# Altium project DEV Board.PrjPCB
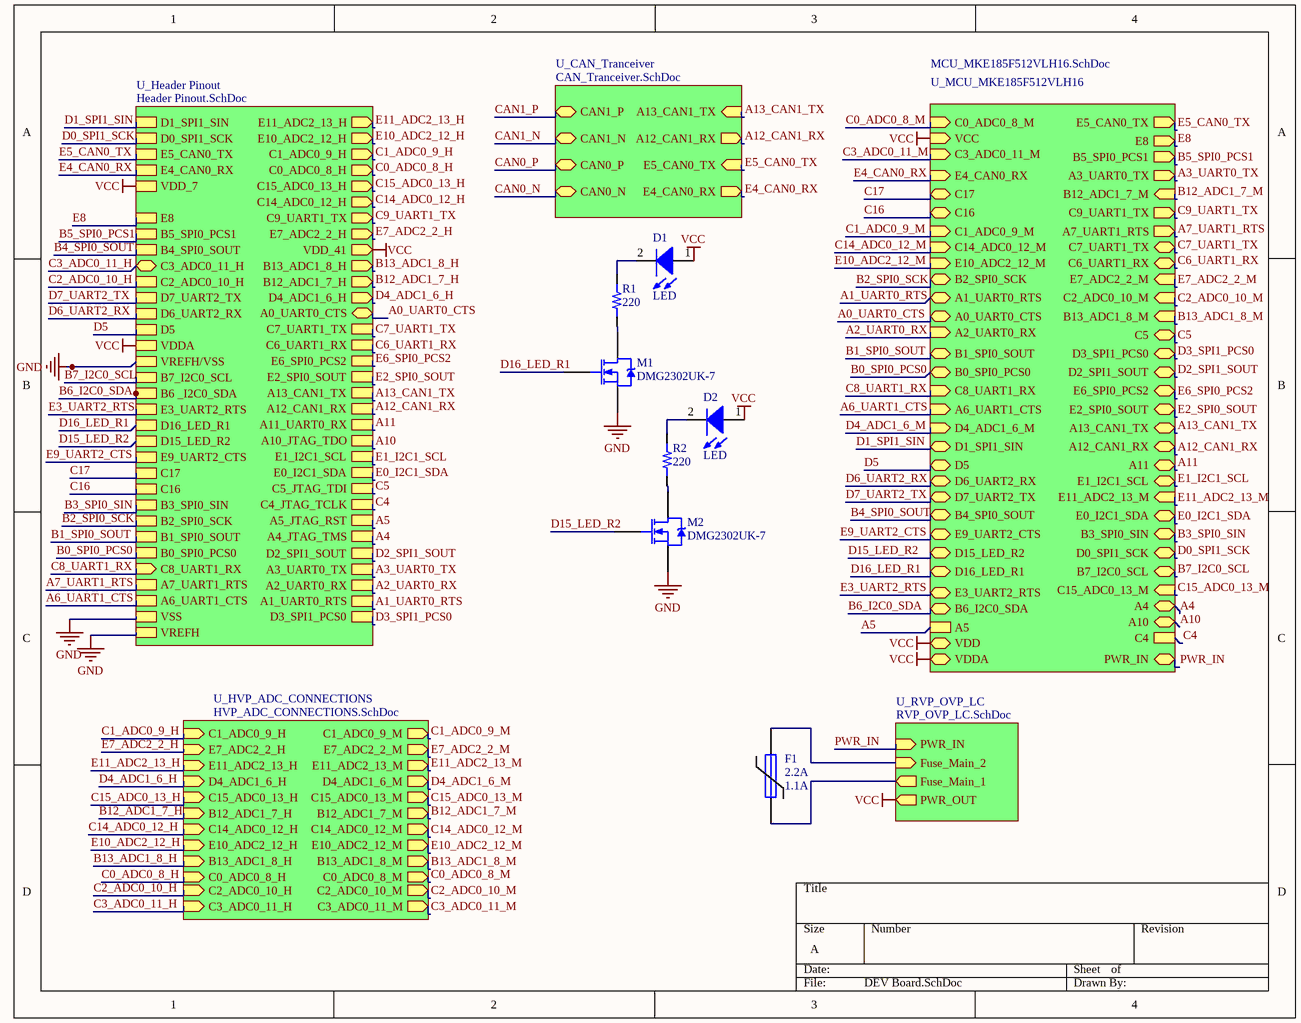
[diagram p0: DEV Board.SchDoc]
5 sheets, 69 parts. Net scope: hierarchical (ports join the sheet entries above them; power ports are global).
Board file: DEV BOARD PCB.PcbDoc
Sheets:
  DEV Board.SchDoc
    U_MCU_MKE185F512VLH16 = MCU_MKE185F512VLH16.SchDoc
    U_CAN_Tranceiver = CAN_Tranceiver.SchDoc
    U_HVP_ADC_CONNECTIONS = HVP_ADC_CONNECTIONS.SchDoc
    U_Header Pinout = Header Pinout.SchDoc

## Sheet DEV Board.SchDoc
size A

### Parts
D1  LED  [0805_LED]
D2  LED  [0805_LED]
F1  2.2A  I_hold: 1.1A  [PIN-W2/E2.8]
M1  DMG2302UK-7  [SOT23-3]
M2  DMG2302UK-7  [SOT23-3]
R1  value 220  [RES 0402/1005]  (hidden comment: Resistor 220 0402 1/10W 1%)
R2  value 220  [RES 0402/1005]  (hidden comment: Resistor 220 0402 1/10W 1%)

### Sub-sheets
U_CAN_Tranceiver = CAN_Tranceiver.SchDoc: A12_CAN1_RX (out), A13_CAN1_TX (in), CAN1_P (bidir), CAN1_N (bidir), E4_CAN0_RX (out), E5_CAN0_TX (in), CAN0_P (bidir), CAN0_N (bidir)
U_Header Pinout = Header Pinout.SchDoc: D1_SPI1_SIN, D0_SPI1_SCK, E11_ADC2_13_H (out), E10_ADC2_12_H (out), E5_CAN0_TX, E4_CAN0_RX, E8, B5_SPI0_PCS1, B4_SPI0_SOUT, D7_UART2_TX, D6_UART2_RX, D5, VDDA, B7_I2C0_SCL, E3_UART2_RTS, E9_UART2_CTS, C1_ADC0_9_H (out), C0_ADC0_8_H (out), C17, C16, C15_ADC0_13_H (out), C14_ADC0_12_H (out), B3_SPI0_SIN, B2_SPI0_SCK, B1_SPI0_SOUT, B0_SPI0_PCS0, C9_UART1_TX (out), C8_UART1_RX (in), A7_UART1_RTS, A6_UART1_CTS, E7_ADC2_2_H (out), VSS, B13_ADC1_8_H (out), B12_ADC1_7_H (out), D4_ADC1_6_H (out), D3_SPI1_PCS0, D2_SPI1_SOUT, A3_UART0_TX, A2_UART0_RX, A1_UART0_RTS, C7_UART1_TX, C6_UART1_RX, E6_SPI0_PCS2, E2_SPI0_SOUT, A13_CAN1_TX, A12_CAN1_RX, A11_UART0_RX, A10_JTAG_TDO, E1_I2C1_SCL, E0_I2C1_SDA, C5_JTAG_TDI, C4_JTAG_TCLK, A5_JTAG_RST, A4_JTAG_TMS, C3_ADC0_11_H (bidir), C2_ADC0_10_H, D16_LED_R1, D15_LED_R2, A0_UART0_CTS (bidir), B6 _I2C0_SDA, VREFH/VSS, VREFH, VDD_7, VDD_41 (out)
U_HVP_ADC_CONNECTIONS = HVP_ADC_CONNECTIONS.SchDoc: B13_ADC1_8_M (out), C15_ADC0_13_M (out), E10_ADC2_12_M (out), E7_ADC2_2_M (out), C14_ADC0_12_M (out), C0_ADC0_8_M (out), E11_ADC2_13_M (out), D4_ADC1_6_M (out), C1_ADC0_9_M (out), B12_ADC1_7_M (out), C1_ADC0_9_H (in), E7_ADC2_2_H (in), E11_ADC2_13_H (in), D4_ADC1_6_H (in), C15_ADC0_13_H (in), C14_ADC0_12_H (in), E10_ADC2_12_H (in), B13_ADC1_8_H (in), C0_ADC0_8_H (in), C2_ADC0_10_H (in), C3_ADC0_11_H (in), C3_ADC0_11_M (out), C2_ADC0_10_M (out), B12_ADC1_7_H (in)
U_MCU_MKE185F512VLH16 = MCU_MKE185F512VLH16.SchDoc: E5_CAN0_TX (out), E4_CAN0_RX (in), E8 (out), B5_SPI0_PCS1 (out), C17 (bidir), C16 (bidir), B3_SPI0_SIN (bidir), B2_SPI0_SCK (bidir), A1_UART0_RTS (bidir), A0_UART0_CTS (bidir), A3_UART0_TX (out), A2_UART0_RX (in), B1_SPI0_SOUT (bidir), B0_SPI0_PCS0 (bidir), C9_UART1_TX (out), C8_UART1_RX (in), A7_UART1_RTS (out), A6_UART1_CTS (in), D5 (bidir), D6_UART2_RX (bidir), D7_UART2_TX (bidir), B4_SPI0_SOUT (bidir), E9_UART2_CTS (bidir), E3_UART2_RTS (bidir), B6_I2C0_SDA (bidir), B7_I2C0_SCL (bidir), D0_SPI1_SCK (bidir), D1_SPI1_SIN (bidir), C7_UART1_TX (bidir), C6_UART1_RX (bidir), E6_SPI0_PCS2 (bidir), E2_SPI0_SOUT (bidir), A13_CAN1_TX (bidir), A12_CAN1_RX (bidir), A11 (bidir), E1_I2C1_SCL (bidir), E0_I2C1_SDA (bidir), D2_SPI1_SOUT (bidir), C5 (bidir), VCC (in), C2_ADC0_10_M (in), C3_ADC0_11_M (in), C1_ADC0_9_M (in), C0_ADC0_8_M (in), C14_ADC0_12_M (in), C15_ADC0_13_M (in), D4_ADC1_6_M (in), E10_ADC2_12_M (in), B12_ADC1_7_M (in), E7_ADC2_2_M (in), E11_ADC2_13_M (in), B13_ADC1_8_M (in), D15_LED_R2 (bidir), D16_LED_R1 (bidir), A4 (bidir), A10 (bidir), C4, A5, D3_SPI1_PCS0 (bidir), VDD (bidir), VDDA (bidir), PWR_IN (bidir)
U_RVP_OVP_LC = RVP_OVP_LC.SchDoc (file not in this document): PWR_IN (in), Fuse_Main_2 (in), Fuse_Main_1 (out), PWR_OUT (out)

### Nets
GND: M1.2(S) M2.2(S) ; sheet U_Header Pinout/VSS, sheet U_Header Pinout/VREFH/VSS, sheet U_Header Pinout/VREFH
VCC: D1.1(A) D2.1(A) ; sheet U_MCU_MKE185F512VLH16/VCC, sheet U_MCU_MKE185F512VLH16/VDD, sheet U_MCU_MKE185F512VLH16/VDDA, sheet U_RVP_OVP_LC/PWR_OUT, sheet U_Header Pinout/VDDA, sheet U_Header Pinout/VDD_7, sheet U_Header Pinout/VDD_41
A0_UART0_CTS: sheet U_MCU_MKE185F512VLH16/A0_UART0_CTS, sheet U_Header Pinout/A0_UART0_CTS
A1_UART0_RTS: sheet U_MCU_MKE185F512VLH16/A1_UART0_RTS, sheet U_Header Pinout/A1_UART0_RTS
A2_UART0_RX: sheet U_MCU_MKE185F512VLH16/A2_UART0_RX, sheet U_Header Pinout/A2_UART0_RX
A3_UART0_TX: sheet U_MCU_MKE185F512VLH16/A3_UART0_TX, sheet U_Header Pinout/A3_UART0_TX
A4: sheet U_MCU_MKE185F512VLH16/A4, sheet U_Header Pinout/A4_JTAG_TMS
A5: sheet U_MCU_MKE185F512VLH16/A5, sheet U_Header Pinout/A5_JTAG_RST
A6_UART1_CTS: sheet U_MCU_MKE185F512VLH16/A6_UART1_CTS, sheet U_Header Pinout/A6_UART1_CTS
A7_UART1_RTS: sheet U_MCU_MKE185F512VLH16/A7_UART1_RTS, sheet U_Header Pinout/A7_UART1_RTS
A10: sheet U_MCU_MKE185F512VLH16/A10, sheet U_Header Pinout/A10_JTAG_TDO
A11: sheet U_MCU_MKE185F512VLH16/A11, sheet U_Header Pinout/A11_UART0_RX
A12_CAN1_RX: sheet U_MCU_MKE185F512VLH16/A12_CAN1_RX, sheet U_CAN_Tranceiver/A12_CAN1_RX, sheet U_Header Pinout/A12_CAN1_RX
A13_CAN1_TX: sheet U_MCU_MKE185F512VLH16/A13_CAN1_TX, sheet U_CAN_Tranceiver/A13_CAN1_TX, sheet U_Header Pinout/A13_CAN1_TX
B0_SPI0_PCS0: sheet U_MCU_MKE185F512VLH16/B0_SPI0_PCS0, sheet U_Header Pinout/B0_SPI0_PCS0
B1_SPI0_SOUT: sheet U_MCU_MKE185F512VLH16/B1_SPI0_SOUT, sheet U_Header Pinout/B1_SPI0_SOUT
B2_SPI0_SCK: sheet U_MCU_MKE185F512VLH16/B2_SPI0_SCK, sheet U_Header Pinout/B2_SPI0_SCK
B3_SPI0_SIN: sheet U_MCU_MKE185F512VLH16/B3_SPI0_SIN, sheet U_Header Pinout/B3_SPI0_SIN
B4_SPI0_SOUT: sheet U_MCU_MKE185F512VLH16/B4_SPI0_SOUT, sheet U_Header Pinout/B4_SPI0_SOUT
B5_SPI0_PCS1: sheet U_MCU_MKE185F512VLH16/B5_SPI0_PCS1, sheet U_Header Pinout/B5_SPI0_PCS1
B6_I2C0_SDA: sheet U_MCU_MKE185F512VLH16/B6_I2C0_SDA, sheet U_Header Pinout/B6 _I2C0_SDA
B7_I2C0_SCL: sheet U_MCU_MKE185F512VLH16/B7_I2C0_SCL, sheet U_Header Pinout/B7_I2C0_SCL
B12_ADC1_7_H: sheet U_HVP_ADC_CONNECTIONS/B12_ADC1_7_H, sheet U_Header Pinout/B12_ADC1_7_H
B12_ADC1_7_M: sheet U_MCU_MKE185F512VLH16/B12_ADC1_7_M, sheet U_HVP_ADC_CONNECTIONS/B12_ADC1_7_M
B13_ADC1_8_H: sheet U_HVP_ADC_CONNECTIONS/B13_ADC1_8_H, sheet U_Header Pinout/B13_ADC1_8_H
B13_ADC1_8_M: sheet U_MCU_MKE185F512VLH16/B13_ADC1_8_M, sheet U_HVP_ADC_CONNECTIONS/B13_ADC1_8_M
C0_ADC0_8_H: sheet U_HVP_ADC_CONNECTIONS/C0_ADC0_8_H, sheet U_Header Pinout/C0_ADC0_8_H
C0_ADC0_8_M: sheet U_MCU_MKE185F512VLH16/C0_ADC0_8_M, sheet U_HVP_ADC_CONNECTIONS/C0_ADC0_8_M
C1_ADC0_9_H: sheet U_HVP_ADC_CONNECTIONS/C1_ADC0_9_H, sheet U_Header Pinout/C1_ADC0_9_H
C1_ADC0_9_M: sheet U_MCU_MKE185F512VLH16/C1_ADC0_9_M, sheet U_HVP_ADC_CONNECTIONS/C1_ADC0_9_M
C2_ADC0_10_H: sheet U_HVP_ADC_CONNECTIONS/C2_ADC0_10_H, sheet U_Header Pinout/C2_ADC0_10_H
C2_ADC0_10_M: sheet U_MCU_MKE185F512VLH16/C2_ADC0_10_M, sheet U_HVP_ADC_CONNECTIONS/C2_ADC0_10_M
C3_ADC0_11_H: sheet U_HVP_ADC_CONNECTIONS/C3_ADC0_11_H, sheet U_Header Pinout/C3_ADC0_11_H
C3_ADC0_11_M: sheet U_MCU_MKE185F512VLH16/C3_ADC0_11_M, sheet U_HVP_ADC_CONNECTIONS/C3_ADC0_11_M
C4: sheet U_MCU_MKE185F512VLH16/C4, sheet U_Header Pinout/C4_JTAG_TCLK
C5: sheet U_MCU_MKE185F512VLH16/C5, sheet U_Header Pinout/C5_JTAG_TDI
C6_UART1_RX: sheet U_MCU_MKE185F512VLH16/C6_UART1_RX, sheet U_Header Pinout/C6_UART1_RX
C7_UART1_TX: sheet U_MCU_MKE185F512VLH16/C7_UART1_TX, sheet U_Header Pinout/C7_UART1_TX
C8_UART1_RX: sheet U_MCU_MKE185F512VLH16/C8_UART1_RX, sheet U_Header Pinout/C8_UART1_RX
C9_UART1_TX: sheet U_MCU_MKE185F512VLH16/C9_UART1_TX, sheet U_Header Pinout/C9_UART1_TX
C14_ADC0_12_H: sheet U_HVP_ADC_CONNECTIONS/C14_ADC0_12_H, sheet U_Header Pinout/C14_ADC0_12_H
C14_ADC0_12_M: sheet U_MCU_MKE185F512VLH16/C14_ADC0_12_M, sheet U_HVP_ADC_CONNECTIONS/C14_ADC0_12_M
C15_ADC0_13_H: sheet U_HVP_ADC_CONNECTIONS/C15_ADC0_13_H, sheet U_Header Pinout/C15_ADC0_13_H
C15_ADC0_13_M: sheet U_MCU_MKE185F512VLH16/C15_ADC0_13_M, sheet U_HVP_ADC_CONNECTIONS/C15_ADC0_13_M
C16: sheet U_MCU_MKE185F512VLH16/C16, sheet U_Header Pinout/C16
C17: sheet U_MCU_MKE185F512VLH16/C17, sheet U_Header Pinout/C17
D0_SPI1_SCK: sheet U_MCU_MKE185F512VLH16/D0_SPI1_SCK, sheet U_Header Pinout/D0_SPI1_SCK
D1_SPI1_SIN: sheet U_MCU_MKE185F512VLH16/D1_SPI1_SIN, sheet U_Header Pinout/D1_SPI1_SIN
D2_SPI1_SOUT: sheet U_MCU_MKE185F512VLH16/D2_SPI1_SOUT, sheet U_Header Pinout/D2_SPI1_SOUT
D3_SPI1_PCS0: sheet U_MCU_MKE185F512VLH16/D3_SPI1_PCS0, sheet U_Header Pinout/D3_SPI1_PCS0
D4_ADC1_6_H: sheet U_HVP_ADC_CONNECTIONS/D4_ADC1_6_H, sheet U_Header Pinout/D4_ADC1_6_H
D4_ADC1_6_M: sheet U_MCU_MKE185F512VLH16/D4_ADC1_6_M, sheet U_HVP_ADC_CONNECTIONS/D4_ADC1_6_M
D5: sheet U_MCU_MKE185F512VLH16/D5, sheet U_Header Pinout/D5
D6_UART2_RX: sheet U_MCU_MKE185F512VLH16/D6_UART2_RX, sheet U_Header Pinout/D6_UART2_RX
D7_UART2_TX: sheet U_MCU_MKE185F512VLH16/D7_UART2_TX, sheet U_Header Pinout/D7_UART2_TX
D15_LED_R2: M2.1(G) ; sheet U_MCU_MKE185F512VLH16/D15_LED_R2, sheet U_Header Pinout/D15_LED_R2
D16_LED_R1: M1.1(G) ; sheet U_MCU_MKE185F512VLH16/D16_LED_R1, sheet U_Header Pinout/D16_LED_R1
E0_I2C1_SDA: sheet U_MCU_MKE185F512VLH16/E0_I2C1_SDA, sheet U_Header Pinout/E0_I2C1_SDA
E1_I2C1_SCL: sheet U_MCU_MKE185F512VLH16/E1_I2C1_SCL, sheet U_Header Pinout/E1_I2C1_SCL
E2_SPI0_SOUT: sheet U_MCU_MKE185F512VLH16/E2_SPI0_SOUT, sheet U_Header Pinout/E2_SPI0_SOUT
E3_UART2_RTS: sheet U_MCU_MKE185F512VLH16/E3_UART2_RTS, sheet U_Header Pinout/E3_UART2_RTS
E4_CAN0_RX: sheet U_MCU_MKE185F512VLH16/E4_CAN0_RX, sheet U_CAN_Tranceiver/E4_CAN0_RX, sheet U_Header Pinout/E4_CAN0_RX
E5_CAN0_TX: sheet U_MCU_MKE185F512VLH16/E5_CAN0_TX, sheet U_CAN_Tranceiver/E5_CAN0_TX, sheet U_Header Pinout/E5_CAN0_TX
E6_SPI0_PCS2: sheet U_MCU_MKE185F512VLH16/E6_SPI0_PCS2, sheet U_Header Pinout/E6_SPI0_PCS2
E7_ADC2_2_H: sheet U_HVP_ADC_CONNECTIONS/E7_ADC2_2_H, sheet U_Header Pinout/E7_ADC2_2_H
E7_ADC2_2_M: sheet U_MCU_MKE185F512VLH16/E7_ADC2_2_M, sheet U_HVP_ADC_CONNECTIONS/E7_ADC2_2_M
E8: sheet U_MCU_MKE185F512VLH16/E8, sheet U_Header Pinout/E8
E9_UART2_CTS: sheet U_MCU_MKE185F512VLH16/E9_UART2_CTS, sheet U_Header Pinout/E9_UART2_CTS
E10_ADC2_12_H: sheet U_HVP_ADC_CONNECTIONS/E10_ADC2_12_H, sheet U_Header Pinout/E10_ADC2_12_H
E10_ADC2_12_M: sheet U_MCU_MKE185F512VLH16/E10_ADC2_12_M, sheet U_HVP_ADC_CONNECTIONS/E10_ADC2_12_M
E11_ADC2_13_H: sheet U_HVP_ADC_CONNECTIONS/E11_ADC2_13_H, sheet U_Header Pinout/E11_ADC2_13_H
E11_ADC2_13_M: sheet U_MCU_MKE185F512VLH16/E11_ADC2_13_M, sheet U_HVP_ADC_CONNECTIONS/E11_ADC2_13_M
PWR_IN: sheet U_MCU_MKE185F512VLH16/PWR_IN, sheet U_RVP_OVP_LC/PWR_IN
NetD1_2: D1.2(K) R1.2
NetD2_2: D2.2(K) R2.2
NetF1_1: F1.1 ; sheet U_RVP_OVP_LC/Fuse_Main_1
NetF1_2: F1.2 ; sheet U_RVP_OVP_LC/Fuse_Main_2
NetM1_3: M1.3(D) R1.1
NetM2_3: M2.3(D) R2.1

### Library data of the parts
D1 D2 = 1: idLED: 1; Name: LED_0805_RED; Value: Red; Vf: 0.7V; Manufacturer_id: 1; Drawer_id: 1; Package: 0805
F1 = 8: Fuse; Manufacturer_id: 1; MfrPartNo: 1206L110/12SLYR; idFuse: 8; Name: Resettable; I_max: 50A; V_max: 12V; Pd_Typ: .8W; Published: 8-Jun-2000; LatestRevisionDate: 17-Jul-2002; LatestRevisionNote: Re-released for DXP Platform.; PackageReference: PIN-W2/E2.8; Publisher: Altium Limited; PackageDescription: Thru-Hole; 2 Leads; Drawer_id: 1; I_trip: 2.2A; Link: https://www.digikey.com/product-detail/en/littelfuse-inc/1206L110-12SLYR/F5764CT-ND/3593809
M1 M2 = 6: MOSFET N-CHANNEL 30V 5A SOT23; Manufacturer_id: 1; idFETs: 6; Value: N_Channel; Vdss: 20V; Id: 2.8A; Rds_On: 90mOhm; Vgs(typ): 800mV; Vgs(Max): 1V; Created_By: Angel; MfrPartNo: DMG2302UK-7; Drawer_id: 1; Name: DMG2302UK-7; Num_Circuits: 1; Package: SOT-23; Link: https://www.digikey.com/product-detail/en/diodes-incorporated/DMG2302UK-7/DMG2302UK-7DICT-ND/6010163; Supplier1: Digi-Key
R1 R2 = 57: Manufacturer_id: 1; idResistor: 57; Name: Res_220_0402_1/10W_1%; Created_By: Nick Mah; Supplier 1: Digi-Key; Drawer_id: 1; Tolerance: 1%; Power: 1/10W; Package: 0402; ComponentLink1Description: Datasheet; Created_Date: 2018-10-20

## Sheet MCU_MKE185F512VLH16.SchDoc: Microcontroller
size A4; DrawnBy: Alvin Ha; DocumentNumber: MCU2018-2; Revision: 2.0; SheetNumber: 2; SheetTotal: 4
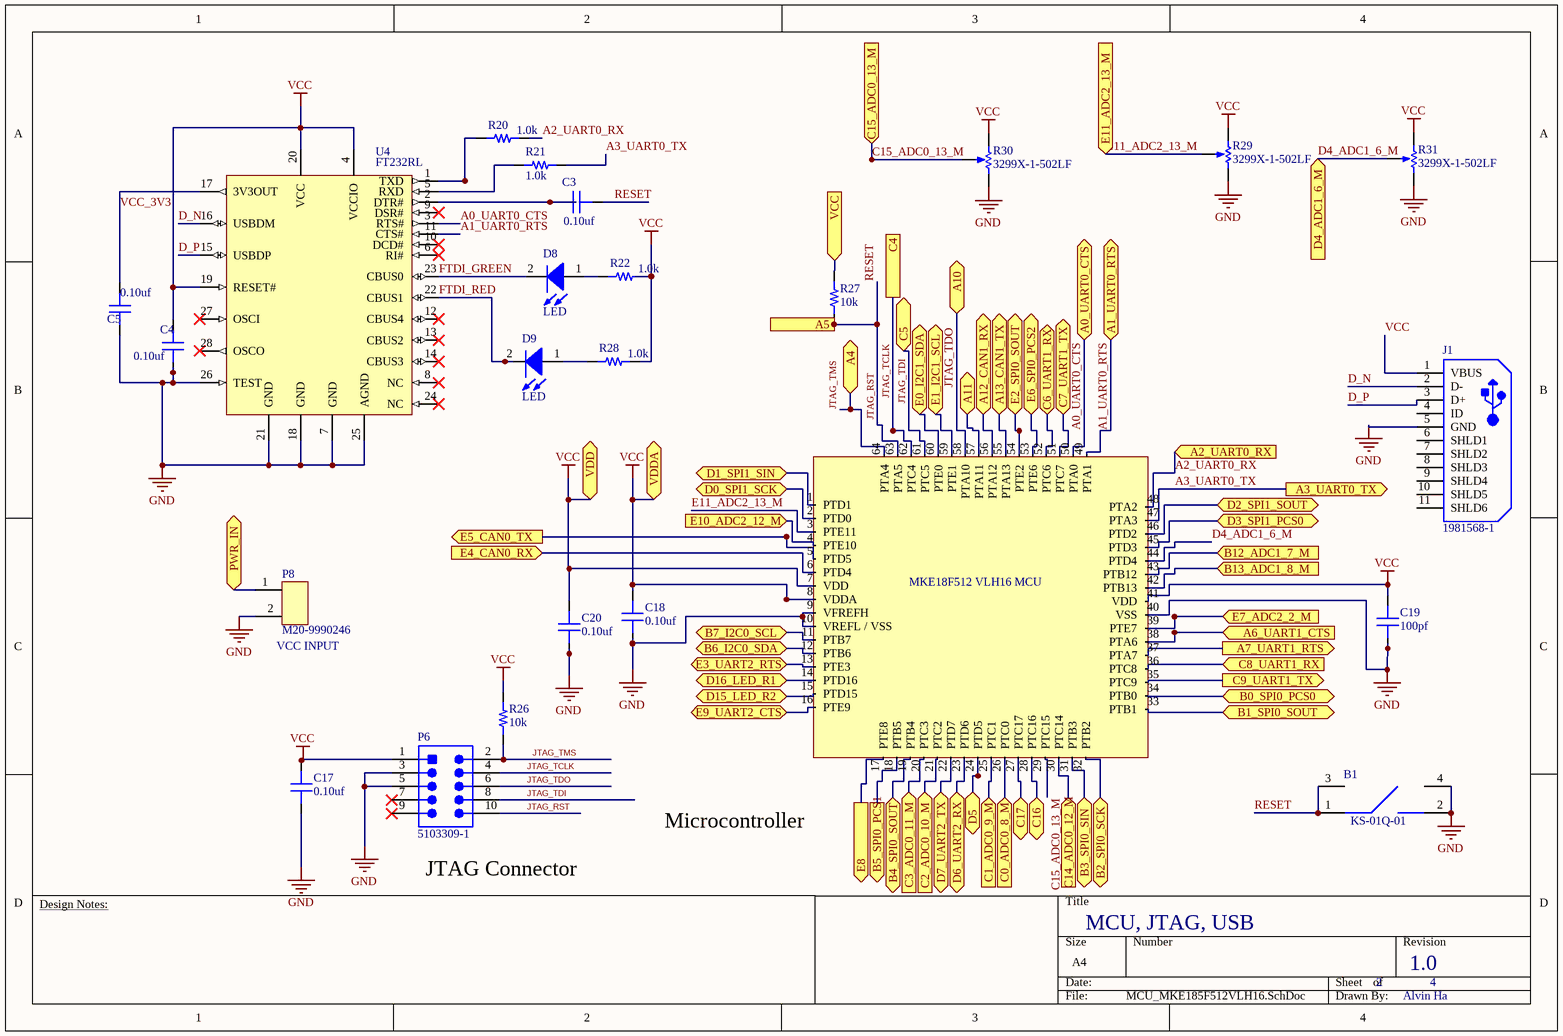
[diagram p1: MCU_MKE185F512VLH16.SchDoc]

### Parts
B1  KS-01Q-01  [KS-01Q-01]
C3  value 0.10uf  [CAP 0603/1608]  (hidden comment: Capacitor MLCC 0.10uf 25V CAP 0603/1608)
C4  value 0.10uf  [CAP 0603/1608]  (hidden comment: Capacitor MLCC 0.10uf 25V CAP 0603/1608)
C5  value 0.10uf  [CAP 0603/1608]  (hidden comment: Capacitor MLCC 0.10uf 25V CAP 0603/1608)
C17  value 0.10uf  [CAP 0603/1608]  (hidden comment: Capacitor MLCC 0.10uf 16V CAP 0603/1608)
C18  value 0.10uf  [CAP 0603/1608]  (hidden comment: Capacitor MLCC 0.10uf 25V CAP 0603/1608)
C19  value 100pf  [CAP 0603/1608]  (hidden comment: Capacitor MLCC 100pf 25V CAP 0603/1608)
C20  value 0.10uf  [CAP 0603/1608]  (hidden comment: Capacitor MLCC 0.10uf 25V CAP 0603/1608)
D8  LED  [0805_LED]
D9  LED  [0805_LED]
J1  1981568-1  [TECO-1981568-5_V]
P6  5103309-1  [HDR2X5_SMT]
P8  M20-9990246  [M20-9990246]
R20  value 1.0k  [RES 0805/2012]  (hidden comment: Resistor 1.0k 0805 1/4W 1%)
R21  value 1.0k  [RES 0805/2012]  (hidden comment: Resistor 1.0k 0805 1/4W 1%)
R22  value 1.0k  [RES 0805/2012]  (hidden comment: Resistor 1.0k 0805 1/4W 1%)
R26  value 10k  [RES 0603/1608]  (hidden comment: Resistor 10k 0603 1/10W 1%)
R27  value 10k  [RES 0603/1608]  (hidden comment: Resistor 10k 0603 1/10W 5%)
R28  value 1.0k  [RES 0805/2012]  (hidden comment: Resistor 1.0k 0805 1/4W 1%)
R29  3299X-1-502LF  [3299X-1-502LF]
R30  3299X-1-502LF  [3299X-1-502LF]
R31  3299X-1-502LF  [3299X-1-502LF]
U3  MKE18F512 VLH16 MCU  [TQFP64]
U4  FT232RL  [SSOP-28]

### Ports
A0_UART0_CTS (bidir), A1_UART0_RTS (bidir), A2_UART0_RX (in), A3_UART0_TX (out), A4 (bidir), A5, A6_UART1_CTS (in), A7_UART1_RTS (out), A10 (bidir), A11 (bidir), A12_CAN1_RX (bidir), A13_CAN1_TX (bidir), B0_SPI0_PCS0 (bidir), B1_SPI0_SOUT (bidir), B2_SPI0_SCK (bidir), B3_SPI0_SIN (bidir), B4_SPI0_SOUT (bidir), B5_SPI0_PCS1 (out), B6_I2C0_SDA (bidir), B7_I2C0_SCL (bidir), B12_ADC1_7_M (in), B13_ADC1_8_M (in), C0_ADC0_8_M (in), C1_ADC0_9_M (in), C2_ADC0_10_M (in), C3_ADC0_11_M (in), C4, C5 (bidir), C6_UART1_RX (bidir), C7_UART1_TX (bidir), C8_UART1_RX (in), C9_UART1_TX (out), C14_ADC0_12_M (in), C15_ADC0_13_M (in), C16 (bidir), C17 (bidir), D0_SPI1_SCK (bidir), D1_SPI1_SIN (bidir), D2_SPI1_SOUT (bidir), D3_SPI1_PCS0 (bidir), D4_ADC1_6_M (in), D5 (bidir), D6_UART2_RX (bidir), D7_UART2_TX (bidir), D15_LED_R2 (bidir), D16_LED_R1 (bidir), E0_I2C1_SDA (bidir), E1_I2C1_SCL (bidir), E2_SPI0_SOUT (bidir), E3_UART2_RTS (bidir), E4_CAN0_RX (in), E5_CAN0_TX (out), E6_SPI0_PCS2 (bidir), E7_ADC2_2_M (in), E8 (out), E9_UART2_CTS (bidir), E10_ADC2_12_M (in), E11_ADC2_13_M (in), PWR_IN (bidir), VCC (in), VDD (bidir), VDDA (bidir)

### Nets
GND: B1.2 B1.4 C4.1 C5.1 C17.1 C18.1 C19.1 C20.1 J1.5(GND) P6.3 P6.5 R29.3(BOT) R30.3(BOT) R31.3(BOT) U3.9(VFREFH) U3.10(VREFL_/_VSS) U3.40(VSS) U4.7(GND) U4.18(GND) U4.21(GND) U4.25(AGND) U4.26(TEST)
VCC: C4.2 C17.2 C18.2 C19.2 C20.2 J1.1(VBUS) P6.1 R22.2 R26.2 R27.2 R28.2 R29.1(TOP) R30.1(TOP) R31.1(TOP) U3.7(VDD) U3.8(VDDA) U3.41(VDD) U4.4(VCCIO) U4.19(RESET#) U4.20(VCC) ; port VCC, port VDDA, port VDD
A0_UART0_CTS: U3.50(PTA0) U4.3(RTS#) ; port A0_UART0_CTS
A1_UART0_RTS: U3.49(PTA1) U4.11(CTS#) ; port A1_UART0_RTS
A2_UART0_RX: R20.2 U3.48(PTA2) ; port A2_UART0_RX
A3_UART0_TX: R21.2 U3.47(PTA3) ; port A3_UART0_TX
A6_UART1_CTS: U3.38(PTA6) ; port A6_UART1_CTS
A7_UART1_RTS: U3.37(PTA7) ; port A7_UART1_RTS
A11: U3.57(PTA11) ; port A11
A12_CAN1_RX: U3.56(PTA12) ; port A12_CAN1_RX
A13_CAN1_TX: U3.55(PTA13) ; port A13_CAN1_TX
B0_SPI0_PCS0: U3.34(PTB0) ; port B0_SPI0_PCS0
B1_SPI0_SOUT: U3.33(PTB1) ; port B1_SPI0_SOUT
B2_SPI0_SCK: U3.32(PTB2) ; port B2_SPI0_SCK
B3_SPI0_SIN: U3.31(PTB3) ; port B3_SPI0_SIN
B4_SPI0_SOUT: U3.19(PTB4) ; port B4_SPI0_SOUT
B5_SPI0_PCS1: U3.18(PTB5) ; port B5_SPI0_PCS1
B6_I2C0_SDA: U3.12(PTB6) ; port B6_I2C0_SDA
B7_I2C0_SCL: U3.11(PTB7) ; port B7_I2C0_SCL
B12_ADC1_7_M: U3.43(PTB12) ; port B12_ADC1_7_M
B13_ADC1_8_M: U3.42(PTB13) ; port B13_ADC1_8_M
C0_ADC0_8_M: U3.26(PTC0) ; port C0_ADC0_8_M
C1_ADC0_9_M: U3.25(PTC1) ; port C1_ADC0_9_M
C2_ADC0_10_M: U3.21(PTC2) ; port C2_ADC0_10_M
C3_ADC0_11_M: U3.20(PTC3) ; port C3_ADC0_11_M
C6_UART1_RX: U3.52(PTC6) ; port C6_UART1_RX
C7_UART1_TX: U3.51(PTC7) ; port C7_UART1_TX
C8_UART1_RX: U3.36(PTC8) ; port C8_UART1_RX
C9_UART1_TX: U3.35(PTC9) ; port C9_UART1_TX
C14_ADC0_12_M: U3.30(PTC14) ; port C14_ADC0_12_M
C15_ADC0_13_M: R30.2(TAP) U3.29(PTC15) ; port C15_ADC0_13_M
C16: U3.28(PTC16) ; port C16
C17: U3.27(PTC17) ; port C17
D0_SPI1_SCK: U3.2(PTD0) ; port D0_SPI1_SCK
D1_SPI1_SIN: U3.1(PTD1) ; port D1_SPI1_SIN
D2_SPI1_SOUT: U3.46(PTD2) ; port D2_SPI1_SOUT
D3_SPI1_PCS0: U3.45(PTD3) ; port D3_SPI1_PCS0
D4_ADC1_6_M: R31.2(TAP) U3.44(PTD4) ; port D4_ADC1_6_M
D5: U3.24(PTD5) ; port D5
D6_UART2_RX: U3.23(PTD6) ; port D6_UART2_RX
D7_UART2_TX: U3.22(PTD7) ; port D7_UART2_TX
D15_LED_R2: U3.15(PTD15) ; port D15_LED_R2
D16_LED_R1: U3.14(PTD16) ; port D16_LED_R1
D_N: J1.2(D-) U4.16(USBDM)
D_P: J1.3(D+) U4.15(USBDP)
E0_I2C1_SDA: U3.60(PTE0) ; port E0_I2C1_SDA
E1_I2C1_SCL: U3.59(PTE1) ; port E1_I2C1_SCL
E2_SPI0_SOUT: U3.54(PTE2) ; port E2_SPI0_SOUT
E3_UART2_RTS: U3.13(PTE3) ; port E3_UART2_RTS
E4_CAN0_RX: U3.6(PTD4) ; port E4_CAN0_RX
E5_CAN0_TX: U3.5(PTD5) ; port E5_CAN0_TX
E6_SPI0_PCS2: U3.53(PTE6) ; port E6_SPI0_PCS2
E7_ADC2_2_M: U3.39(PTE7) ; port E7_ADC2_2_M
E8: U3.17(PTE8) ; port E8
E9_UART2_CTS: U3.16(PTE9) ; port E9_UART2_CTS
E10_ADC2_12_M: U3.4(PTE10) ; port E10_ADC2_12_M
E11_ADC2_13_M: R29.2(TAP) U3.3(PTE11) ; port E11_ADC2_13_M
FTDI_GREEN: D8.2(K) U4.23(CBUS0)
FTDI_RED: D9.2(K) U4.22(CBUS1)
JTAG_RST: B1.1 B1.3 C3.2 P6.10 R27.1 U3.63(PTA5) ; port A5  [also labelled RESET]  [project net A5]
JTAG_TCLK: P6.4 U3.62(PTC4) ; port C4  [project net C4]
JTAG_TDI: P6.8 U3.61(PTC5) ; port C5  [project net C5]
JTAG_TDO: P6.6 U3.58(PTA10) ; port A10  [project net A10]
JTAG_TMS: P6.2 R26.1 U3.64(PTA4) ; port A4  [project net A4]
PWR_IN: P8.1 ; port PWR_IN
VCC_3V3: C5.2 U4.17(3V3OUT)
NetC3_1: C3.1 U4.2(DTR#)
NetD8_1: D8.1(A) R22.1
NetD9_1: D9.1(A) R28.1
NetR20_1: R20.1 U4.1(TXD)
NetR21_1: R21.1 U4.5(RXD)

Not connected (* = marked no-connect by the designer): J1 4(ID) 6(SHLD1) 7(SHLD2) 8(SHLD3) 9(SHLD4) 10(SHLD5) 11(SHLD6); P6 7* 9*; P8 2; U4 6(RI#)* 8(NC)* 9(DSR#)* 10(DCD#)* 12(CBUS4)* 13(CBUS2)* 14(CBUS3)* 24(NC)* 27(OSCI)* 28(OSCO)*

### Notes on the sheet
- (near P8) VCC INPUT
- (near U3) Microcontroller
- (near P6) JTAG Connector
- MCU, JTAG, USB
- 1.0
- Design Notes:

### Library data of the parts
B1 = 7: RESET button; Manufacturer_id: 1; idTable: 7; Value: NULL; Num_Contacts: 4; Num_Rows: 2; Pitch: 5; Created_By: Austin; Drawer_id: 1; Name: KS-01Q-01; Voltage_Rating: Null; Package: NULL; MfrPartNo: KS-01Q-01; Link: https://www.digikey.com/product-detail/en/e-switch/KS-01Q-01/EG4791-ND/2116270; ComponentLink1Description: null; ComponentLink1URL: Null; Supplier1: e-switch; Supplier1PartNo: EG4791-ND; Created_Date: 12/15/2018; Updated_By: Null
C3-C5 C18 C20 = 583: Manufacturer_id: 1; idCapacitor: 583; Name: Cap_0.10uf_25V_CAP 0603/1608; Dielectric: Ceramic; Created_By: Nick Mah; Drawer_id: 1; Voltage_Rating: 25V; Package: CAP 0603/1608; Created_Date: 10/20/2018
C17 = 223: Manufacturer_id: 1; idCapacitor: 223; Name: Cap_0.10uf_16V_CAP 0603/1608; Dielectric: Ceramic; Created_By: Nick Mah; Drawer_id: 1; Voltage_Rating: 16V; Package: CAP 0603/1608; Created_Date: 10/20/2018
C19 = 529: Manufacturer_id: 1; idCapacitor: 529; Name: Cap_100pf_25V_CAP 0603/1608; Dielectric: Ceramic; Created_By: Nick Mah; Drawer_id: 1; Voltage_Rating: 25V; Package: CAP 0603/1608; Created_Date: 10/20/2018
D8 = 2: Manufacturer_id: 1; idLED: 2; Name: CMD17_0805_GREEN; Value: Green; Brightness: 7mcd; Id: 20mA; Vf: 2.1V; Drawer_id: 1; Link: https://www.digikey.com/product-detail/en/visual-communications-company-vcc/CMD17-21VGD-TR8/L62505CT-ND/254936; Package: 0805
D9 = 1: as D1 on sheet DEV Board; Manufacturer_id: 1; Drawer_id: 1; Package: 0805
J1 = 5: USB Micro Type B; Manufacturer_id: 1; idConn: 5; Name: TE USB Micro; Value: CONN; Created_By: Aiku; MfrPartNo: 1981568-1; Drawer_id: 1; Num_Contacts: 5; Link: https://www.mouser.com/ProductDetail/TE-Connectivity-AMP/1981568-1?qs=sGAEpiMZZMulM8LPOQ%252bykzEIUPbUCiSfqsfxH3Oq%252bYo%3d; ComponentLink1Description: Datasheet; Supplier1: TE; Created_Date: 10/20/2018
P6 = 4: 2 row connector; Manufacturer_id: 1; idConn: 4; Name: CONN_TE_2X5POS; Value: CONN; Voltage_Rating: None; Num_Contacts: 10; Num_Rows: 2; Pitch: 2.54mm; Created_By: Aiku; Drawer_id: 1; MfrPartNo: 5103309-1; Link: https://www.digikey.com/product-detail/en/5103309-1/A33160-ND/1114898?utm_campaign=buynow&WT.z_cid=ref_octopart_dkc_buynow&utm_medium=aggregator&curr=usd&site=us&utm_source=octopart; ComponentLink1Description: Datasheet
P8 = 25: 2 Pin VCC Power Header, Male; Manufacturer_id: 1; idConn: 25; Value: CONN; Voltage_Rating: Null; Num_Contacts: 2; Pitch: 2.54; Created_By: Austin; Drawer_id: 1; Name: M20-9990246; Num_Rows: Null; Package: Conn; MfrPartNo: M20-9990246; Link: https://www.digikey.com/product-detail/en/harwin-inc/M20-9990246/952-2262-ND/3728226; ComponentLink1Description: Null; ComponentLink1URL: https://www.digikey.com/product-detail/en/harwin-inc/M20-9990246/952-2262-ND/3728226; Supplier1: Digi-Key; Supplier1PartNo: 952-2262-ND; Created_Date: 12/15/2018; Updated_By: Null
R20-R22 R28 = 721: Manufacturer_id: 1; idResistor: 721; Name: Res_1.0k_0805_1/4W_1%; Created_By: Nick Mah; Supplier 1: Digi-Key; Drawer_id: 1; Tolerance: 1%; Power: 1/4W; Package: 0805; ComponentLink1Description: Datasheet; Created_Date: 2018-10-20
R26 = 313: Manufacturer_id: 1; idResistor: 313; Name: Res_10k_0603_1/10W_1%; Created_By: Nick Mah; Supplier 1: Digi-Key; Drawer_id: 1; Tolerance: 1%; Power: 1/10W; Package: 0603; ComponentLink1Description: Datasheet; Created_Date: 2018-10-20
R27 = 1393: Manufacturer_id: 1; idResistor: 1393; Name: Res_10k_0603_1/10W_5%; Created_By: Nick Mah; Supplier 1: Digi-Key; Drawer_id: 1; Tolerance: 5%; Power: 1/10W; Package: 0603; ComponentLink1Description: Datasheet; Created_Date: 2018-10-20
R29-R31 = 6: Manufacturer_id: 1; idTable: 6; Value: 5K; Num_Contacts: 3; Pitch: 2.54mm; Drawer_id: 1; Name: 3299X-1-502LF; MfrPartNo: 3299X-1-502LF; Link: https://www.digikey.com/product-detail/en/bourns-inc/3299X-1-502LF/3299X-502LF-ND/1088167; ComponentLink1Description: Datasheet
U3 = 1: idMCU: 1; Manufacturer_id: 1; Drawer_id: 1; Name: MKE18F512VLH16 MCU
U4 = 3: Manufacturer_id: 1; idIC_Interface: 3; Name: USB FTDI; Protocol: UART; Vin(Min): 3.3; Vin(Max): 5.25; Created_By: Kyle; Drawer_id: 1; MfrPartNo: FT232RL; Link: https://www.digikey.com/product-detail/en/ftdi-future-technology-devices-international-ltd/FT232RL-REEL/768-1007-1-ND/1836402

## Sheet CAN_Tranceiver.SchDoc
size A
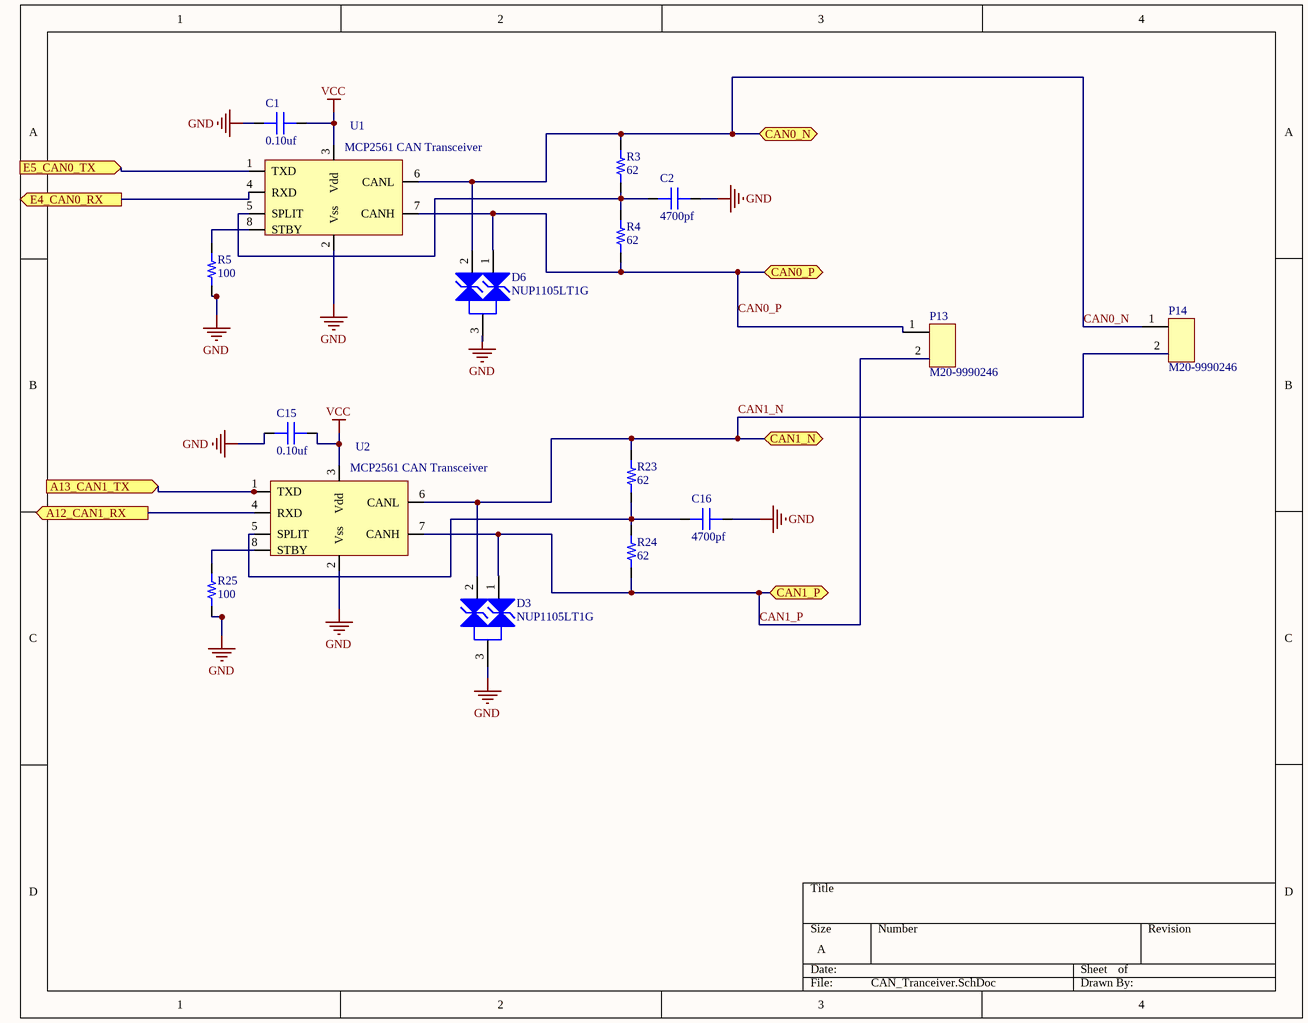
[diagram p2: CAN_Tranceiver.SchDoc]

### Parts
C1  value 0.10uf  [CAP 0603/1608]  (hidden comment: Capacitor MLCC 0.10uf 50V CAP 0603/1608)
C2  value 4700pf  [CAP 0603/1608]  (hidden comment: Capacitor MLCC 4700pf 50V CAP 0603/1608)
C15  value 0.10uf  [CAP 0603/1608]  (hidden comment: Capacitor MLCC 0.10uf 50V CAP 0603/1608)
C16  value 4700pf  [CAP 0603/1608]  (hidden comment: Capacitor MLCC 4700pf 50V CAP 0603/1608)
D3  NUP1105LT1G  [SOT-23 (TO-236)]
D6  NUP1105LT1G  [SOT-23 (TO-236)]
P13  M20-9990246  [M20-9990246]
P14  M20-9990246  [M20-9990246]
R3  value 62  [RES 0603/1608]  (hidden comment: Resistor 62 0603 1/10W 5%)
R4  value 62  [RES 0603/1608]  (hidden comment: Resistor 62 0603 1/10W 5%)
R5  value 100  [RES 0603/1608]  (hidden comment: Resistor 100 0603 1/10W 10%)
R23  value 62  [RES 0603/1608]  (hidden comment: Resistor 62 0603 1/10W 5%)
R24  value 62  [RES 0603/1608]  (hidden comment: Resistor 62 0603 1/10W 5%)
R25  value 100  [RES 0603/1608]  (hidden comment: Resistor 100 0603 1/10W 10%)
U1  MCP2561 CAN Transceiver  [SOIC-8]
U2  MCP2561 CAN Transceiver  [SOIC-8]

### Ports
A12_CAN1_RX (out), A13_CAN1_TX (in), CAN0_N (bidir), CAN0_P (bidir), CAN1_N (bidir), CAN1_P (bidir), E4_CAN0_RX (out), E5_CAN0_TX (in)

### Nets
GND: C1.1 C2.1 C15.1 C16.1 D3.3(K) D6.3(K) R5.1 R25.1 U1.2(Vss) U2.2(Vss)
VCC: C1.2 C15.2 U1.3(Vdd) U2.3(Vdd)
A12_CAN1_RX: U2.4(RXD) ; port A12_CAN1_RX
A13_CAN1_TX: U2.1(TXD) ; port A13_CAN1_TX
CAN0_N: D6.2(K) P14.1 R3.1 U1.6(CANL) ; port CAN0_N
CAN0_P: D6.1(K) P13.1 R4.2 U1.7(CANH) ; port CAN0_P
CAN1_N: D3.2(K) P14.2 R23.1 U2.6(CANL) ; port CAN1_N
CAN1_P: D3.1(K) P13.2 R24.2 U2.7(CANH) ; port CAN1_P
E4_CAN0_RX: U1.4(RXD) ; port E4_CAN0_RX
E5_CAN0_TX: U1.1(TXD) ; port E5_CAN0_TX
NetC2_2: C2.2 R3.2 R4.1 U1.5(SPLIT)
NetC16_2: C16.2 R23.2 R24.1 U2.5(SPLIT)
NetR5_2: R5.2 U1.8(STBY)
NetR25_2: R25.2 U2.8(STBY)

### Library data of the parts
C1 C15 = 943: Manufacturer_id: 1; idCapacitor: 943; Name: Cap_0.10uf_50V_CAP 0603/1608; Dielectric: Ceramic; Created_By: Nick Mah; Drawer_id: 1; Voltage_Rating: 50V; Package: CAP 0603/1608; Created_Date: 10/20/2018
C2 C16 = 929: Manufacturer_id: 1; idCapacitor: 929; Name: Cap_4700pf_50V_CAP 0603/1608; Dielectric: Ceramic; Created_By: Nick Mah; Drawer_id: 1; Voltage_Rating: 50V; Package: CAP 0603/1608; Created_Date: 10/20/2018
D3 D6 = 7: ESD Protection Diode; Manufacturer_id: 1; idDiode: 7; Name: SOT-23_350W_Zener; Value: TVS_24V; Type: Zener; Ic: 8A; Power: 350W; Drawer_id: 1; Num_Circuits: 1; Package: SOT-23; MfrPartNo: NUP1105LT1G; Link: https://www.digikey.com/product-detail/en/on-semiconductor/NUP1105LT1G/NUP1105LT1GOSCT-ND/2122067; ComponentLink1URL: https://www.digikey.com/product-detail/en/on-semiconductor/NUP1105LT1G/NUP1105LT1GOSCT-ND/2122067; Supplier1: Digikey; Supplier1PartNo: NUP1105LT1GOSCT-ND
P13 P14 = 25: as P8 on sheet MCU_MKE185F512VLH16; Drawer_id: 1; Name: M20-9990246; Num_Rows: Null; Package: Conn; MfrPartNo: M20-9990246; Link: https://www.digikey.com/product-detail/en/harwin-inc/M20-9990246/952-2262-ND/3728226; ComponentLink1Description: Null; ComponentLink1URL: https://www.digikey.com/product-detail/en/harwin-inc/M20-9990246/952-2262-ND/3728226; Supplier1: Digi-Key; Supplier1PartNo: 952-2262-ND; Created_Date: 12/15/2018; Updated_By: Null
R3 R4 R23 R24 = 1340: Manufacturer_id: 1; idResistor: 1340; Name: Res_62_0603_1/10W_5%; Created_By: Nick Mah; Supplier 1: Digi-Key; Drawer_id: 1; Tolerance: 5%; Power: 1/10W; Package: 0603; ComponentLink1Description: Datasheet; Created_Date: 2018-10-20
R5 R25 = 2293: Manufacturer_id: 1; idResistor: 2293; Name: Res_100_0603_1/10W_10%; Created_By: Nick Mah; Supplier 1: Digi-Key; Drawer_id: 1; Tolerance: 10%; Power: 1/10W; Package: 0603; ComponentLink1Description: Datasheet; Created_Date: 2018-10-20
U1 U2 = 5: Manufacturer_id: 1; idIC_Interface: 5; Value: CAN/UART; Data_Rate: 1Mbps; Vin(Min): 4.5V; Vin(Max): 5.5V; Created_By: Angel Delgado; Drawer_id: 1; Name: CAN Transceiver; Type: Transceiver; Protocol: CAN; Num_Circuits: 1; Package: SOIC-8; MfrPartNo: MCP2561; Link: https://www.digikey.com/product-detail/en/microchip-technology/MCP2561T-E-SN/MCP2561T-E-SNCT-ND/5148846

## Sheet HVP_ADC_CONNECTIONS.SchDoc
size A
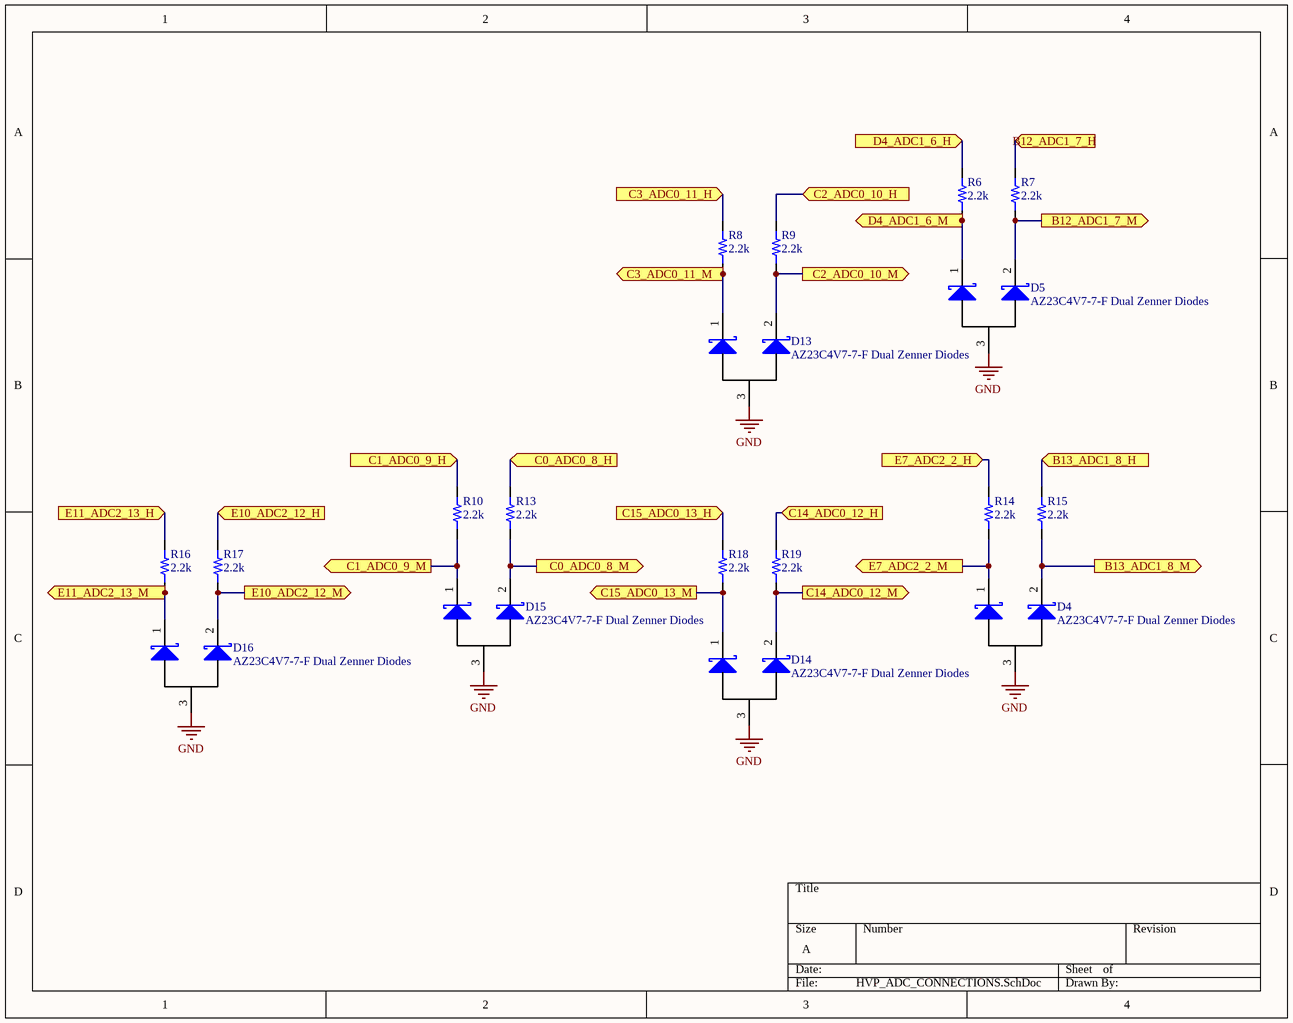
[diagram p3: HVP_ADC_CONNECTIONS.SchDoc]

### Parts
D4  AZ23C4V7-7-F Dual Zenner Diodes  [SOT23-3]
D5  AZ23C4V7-7-F Dual Zenner Diodes  [SOT23-3]
D13  AZ23C4V7-7-F Dual Zenner Diodes  [SOT23-3]
D14  AZ23C4V7-7-F Dual Zenner Diodes  [SOT23-3]
D15  AZ23C4V7-7-F Dual Zenner Diodes  [SOT23-3]
D16  AZ23C4V7-7-F Dual Zenner Diodes  [SOT23-3]
R6  value 2.2k  [RES 0402/1005]  (hidden comment: Resistor 2.2k 0402 1/10W 1%)
R7  value 2.2k  [RES 0402/1005]  (hidden comment: Resistor 2.2k 0402 1/10W 1%)
R8  value 2.2k  [RES 0402/1005]  (hidden comment: Resistor 2.2k 0402 1/10W 1%)
R9  value 2.2k  [RES 0402/1005]  (hidden comment: Resistor 2.2k 0402 1/10W 1%)
R10  value 2.2k  [RES 0402/1005]  (hidden comment: Resistor 2.2k 0402 1/10W 1%)
R13  value 2.2k  [RES 0402/1005]  (hidden comment: Resistor 2.2k 0402 1/10W 1%)
R14  value 2.2k  [RES 0402/1005]  (hidden comment: Resistor 2.2k 0402 1/10W 1%)
R15  value 2.2k  [RES 0402/1005]  (hidden comment: Resistor 2.2k 0402 1/10W 1%)
R16  value 2.2k  [RES 0402/1005]  (hidden comment: Resistor 2.2k 0402 1/10W 1%)
R17  value 2.2k  [RES 0402/1005]  (hidden comment: Resistor 2.2k 0402 1/10W 1%)
R18  value 2.2k  [RES 0402/1005]  (hidden comment: Resistor 2.2k 0402 1/10W 1%)
R19  value 2.2k  [RES 0402/1005]  (hidden comment: Resistor 2.2k 0402 1/10W 1%)

### Ports
B12_ADC1_7_H (in), B12_ADC1_7_M (out), B13_ADC1_8_H (in), B13_ADC1_8_M (out), C0_ADC0_8_H (in), C0_ADC0_8_M (out), C1_ADC0_9_H (in), C1_ADC0_9_M (out), C2_ADC0_10_H (in), C2_ADC0_10_M (out), C3_ADC0_11_H (in), C3_ADC0_11_M (out), C14_ADC0_12_H (in), C14_ADC0_12_M (out), C15_ADC0_13_H (in), C15_ADC0_13_M (out), D4_ADC1_6_H (in), D4_ADC1_6_M (out), E7_ADC2_2_H (in), E7_ADC2_2_M (out), E10_ADC2_12_H (in), E10_ADC2_12_M (out), E11_ADC2_13_H (in), E11_ADC2_13_M (out)

### Nets
GND: D4.3 D5.3 D13.3 D14.3 D15.3 D16.3
B12_ADC1_7_H: R7.2 ; port B12_ADC1_7_H
B12_ADC1_7_M: D5.2 R7.1 ; port B12_ADC1_7_M
B13_ADC1_8_H: R15.2 ; port B13_ADC1_8_H
B13_ADC1_8_M: D4.2 R15.1 ; port B13_ADC1_8_M
C0_ADC0_8_H: R13.2 ; port C0_ADC0_8_H
C0_ADC0_8_M: D15.2 R13.1 ; port C0_ADC0_8_M
C1_ADC0_9_H: R10.2 ; port C1_ADC0_9_H
C1_ADC0_9_M: D15.1 R10.1 ; port C1_ADC0_9_M
C2_ADC0_10_H: R9.2 ; port C2_ADC0_10_H
C2_ADC0_10_M: D13.2 R9.1 ; port C2_ADC0_10_M
C3_ADC0_11_H: R8.2 ; port C3_ADC0_11_H
C3_ADC0_11_M: D13.1 R8.1 ; port C3_ADC0_11_M
C14_ADC0_12_H: R19.2 ; port C14_ADC0_12_H
C14_ADC0_12_M: D14.2 R19.1 ; port C14_ADC0_12_M
C15_ADC0_13_H: R18.2 ; port C15_ADC0_13_H
C15_ADC0_13_M: D14.1 R18.1 ; port C15_ADC0_13_M
D4_ADC1_6_H: R6.2 ; port D4_ADC1_6_H
D4_ADC1_6_M: D5.1 R6.1 ; port D4_ADC1_6_M
E7_ADC2_2_H: R14.2 ; port E7_ADC2_2_H
E7_ADC2_2_M: D4.1 R14.1 ; port E7_ADC2_2_M
E10_ADC2_12_H: R17.2 ; port E10_ADC2_12_H
E10_ADC2_12_M: D16.2 R17.1 ; port E10_ADC2_12_M
E11_ADC2_13_H: R16.2 ; port E11_ADC2_13_H
E11_ADC2_13_M: D16.1 R16.1 ; port E11_ADC2_13_M

### Library data of the parts
D4 D5 D13-D16 = 14: DIODE ZENER ARRAY 4.7V SOT23-3; Manufacturer_id: 1; idDiode: 14; Num_Circuits: 2; Power: 300mW; Created_By: Angel Delgado; Drawer_id: 1; Name: AZ23C4V7-7-F; Value: 4.7V; Type: Zener Array; Package: SOT23-3; MfrPartNo: AZ23C4V7-7-F; Link: https://www.digikey.com/product-detail/en/diodes-incorporated/AZ23C4V7-7-F/AZ23C4V7-FDICT-ND/815309; Supplier1: Digi-Key
R6-R10 R13-R19 = 81: Manufacturer_id: 1; idResistor: 81; Name: Res_2.2k_0402_1/10W_1%; Created_By: Nick Mah; Supplier 1: Digi-Key; Drawer_id: 1; Tolerance: 1%; Power: 1/10W; Package: 0402; ComponentLink1Description: Datasheet; Created_Date: 2018-10-20

## Sheet Header Pinout.SchDoc
size A
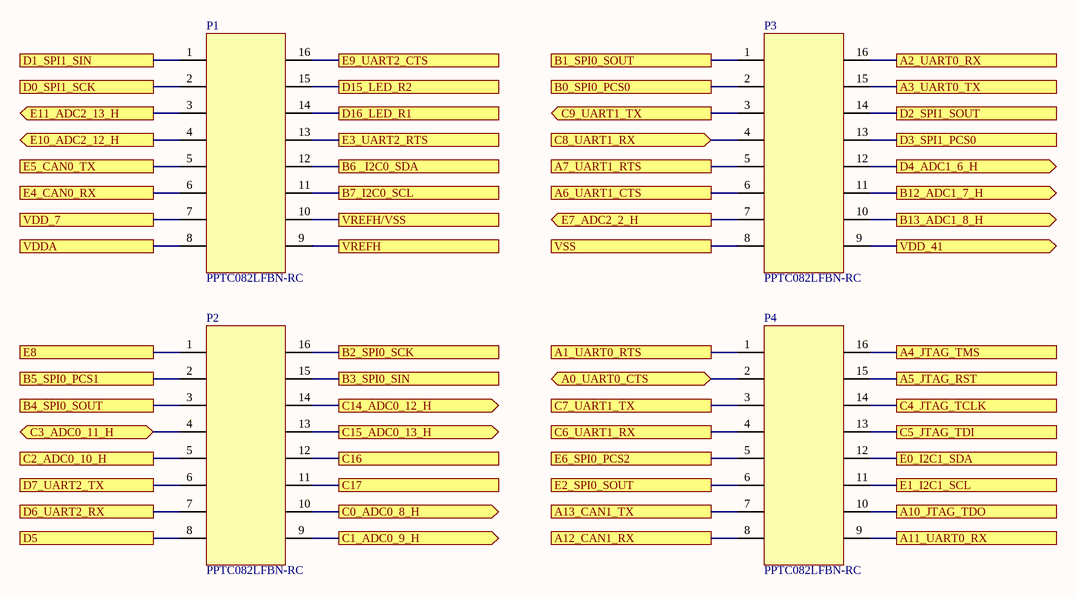
[diagram p4: Header Pinout.SchDoc]

### Parts
P1  PPTC082LFBN-RC  [PPTC082LFBN-RC]
P2  PPTC082LFBN-RC  [PPTC082LFBN-RC]
P3  PPTC082LFBN-RC  [PPTC082LFBN-RC]
P4  PPTC082LFBN-RC  [PPTC082LFBN-RC]

### Ports
A0_UART0_CTS (bidir), A1_UART0_RTS, A2_UART0_RX, A3_UART0_TX, A4_JTAG_TMS, A5_JTAG_RST, A6_UART1_CTS, A7_UART1_RTS, A10_JTAG_TDO, A11_UART0_RX, A12_CAN1_RX, A13_CAN1_TX, B0_SPI0_PCS0, B1_SPI0_SOUT, B2_SPI0_SCK, B3_SPI0_SIN, B4_SPI0_SOUT, B5_SPI0_PCS1, B6 _I2C0_SDA, B7_I2C0_SCL, B12_ADC1_7_H (out), B13_ADC1_8_H (out), C0_ADC0_8_H (out), C1_ADC0_9_H (out), C2_ADC0_10_H, C3_ADC0_11_H (bidir), C4_JTAG_TCLK, C5_JTAG_TDI, C6_UART1_RX, C7_UART1_TX, C8_UART1_RX (in), C9_UART1_TX (out), C14_ADC0_12_H (out), C15_ADC0_13_H (out), C16, C17, D0_SPI1_SCK, D1_SPI1_SIN, D2_SPI1_SOUT, D3_SPI1_PCS0, D4_ADC1_6_H (out), D5, D6_UART2_RX, D7_UART2_TX, D15_LED_R2, D16_LED_R1, E0_I2C1_SDA, E1_I2C1_SCL, E2_SPI0_SOUT, E3_UART2_RTS, E4_CAN0_RX, E5_CAN0_TX, E6_SPI0_PCS2, E7_ADC2_2_H (out), E8, E9_UART2_CTS, E10_ADC2_12_H (out), E11_ADC2_13_H (out), VDD_7, VDD_41 (out), VDDA, VREFH, VREFH/VSS, VSS

### Nets
GND: P1.9 P1.10 P3.8 ; port VREFH/VSS, port VREFH, port VSS
VCC: P1.7 P1.8 P3.9 ; port VDD_7, port VDDA, port VDD_41
A0_UART0_CTS: P4.2 ; port A0_UART0_CTS
A1_UART0_RTS: P4.1 ; port A1_UART0_RTS
A2_UART0_RX: P3.16 ; port A2_UART0_RX
A3_UART0_TX: P3.15 ; port A3_UART0_TX
A4: P4.16 ; port A4_JTAG_TMS
A5: P4.15 ; port A5_JTAG_RST
A6_UART1_CTS: P3.6 ; port A6_UART1_CTS
A7_UART1_RTS: P3.5 ; port A7_UART1_RTS
A10: P4.10 ; port A10_JTAG_TDO
A11: P4.9 ; port A11_UART0_RX
A12_CAN1_RX: P4.8 ; port A12_CAN1_RX
A13_CAN1_TX: P4.7 ; port A13_CAN1_TX
B0_SPI0_PCS0: P3.2 ; port B0_SPI0_PCS0
B1_SPI0_SOUT: P3.1 ; port B1_SPI0_SOUT
B2_SPI0_SCK: P2.16 ; port B2_SPI0_SCK
B3_SPI0_SIN: P2.15 ; port B3_SPI0_SIN
B4_SPI0_SOUT: P2.3 ; port B4_SPI0_SOUT
B5_SPI0_PCS1: P2.2 ; port B5_SPI0_PCS1
B6_I2C0_SDA: P1.12 ; port B6 _I2C0_SDA
B7_I2C0_SCL: P1.11 ; port B7_I2C0_SCL
B12_ADC1_7_H: P3.11 ; port B12_ADC1_7_H
B13_ADC1_8_H: P3.10 ; port B13_ADC1_8_H
C0_ADC0_8_H: P2.10 ; port C0_ADC0_8_H
C1_ADC0_9_H: P2.9 ; port C1_ADC0_9_H
C2_ADC0_10_H: P2.5 ; port C2_ADC0_10_H
C3_ADC0_11_H: P2.4 ; port C3_ADC0_11_H
C4: P4.14 ; port C4_JTAG_TCLK
C5: P4.13 ; port C5_JTAG_TDI
C6_UART1_RX: P4.4 ; port C6_UART1_RX
C7_UART1_TX: P4.3 ; port C7_UART1_TX
C8_UART1_RX: P3.4 ; port C8_UART1_RX
C9_UART1_TX: P3.3 ; port C9_UART1_TX
C14_ADC0_12_H: P2.14 ; port C14_ADC0_12_H
C15_ADC0_13_H: P2.13 ; port C15_ADC0_13_H
C16: P2.12 ; port C16
C17: P2.11 ; port C17
D0_SPI1_SCK: P1.2 ; port D0_SPI1_SCK
D1_SPI1_SIN: P1.1 ; port D1_SPI1_SIN
D2_SPI1_SOUT: P3.14 ; port D2_SPI1_SOUT
D3_SPI1_PCS0: P3.13 ; port D3_SPI1_PCS0
D4_ADC1_6_H: P3.12 ; port D4_ADC1_6_H
D5: P2.8 ; port D5
D6_UART2_RX: P2.7 ; port D6_UART2_RX
D7_UART2_TX: P2.6 ; port D7_UART2_TX
D15_LED_R2: P1.15 ; port D15_LED_R2
D16_LED_R1: P1.14 ; port D16_LED_R1
E0_I2C1_SDA: P4.12 ; port E0_I2C1_SDA
E1_I2C1_SCL: P4.11 ; port E1_I2C1_SCL
E2_SPI0_SOUT: P4.6 ; port E2_SPI0_SOUT
E3_UART2_RTS: P1.13 ; port E3_UART2_RTS
E4_CAN0_RX: P1.6 ; port E4_CAN0_RX
E5_CAN0_TX: P1.5 ; port E5_CAN0_TX
E6_SPI0_PCS2: P4.5 ; port E6_SPI0_PCS2
E7_ADC2_2_H: P3.7 ; port E7_ADC2_2_H
E8: P2.1 ; port E8
E9_UART2_CTS: P1.16 ; port E9_UART2_CTS
E10_ADC2_12_H: P1.4 ; port E10_ADC2_12_H
E11_ADC2_13_H: P1.3 ; port E11_ADC2_13_H

### Library data of the parts
P1-P4 = 23: 2x8 female header; Manufacturer_id: 1; idConn: 23; Value: CONN; Voltage_Rating: V; Num_Contacts: 16; Num_Rows: 2; Pitch: 2.54; Created_By: Austin; Updated_By: Null; Drawer_id: 1; Name: PPTC082LFBN-RC; Package: Conn; MfrPartNo: PPTC082LFBN-RC; Link: https://www.digikey.com/product-detail/en/sullins-connector-solutions/PPTC082LFBN-RC/S7076-ND/810214; ComponentLink1Description: Null; ComponentLink1URL: Null; Supplier1: Digi-Key; Supplier1PartNo: S7076-ND; Created_Date: 12/15/2018

## Nets that join several sheets
GND: DEV Board (M1.2 M2.2), MCU_MKE185F512VLH16 (22 pins), CAN_Tranceiver (10 pins), HVP_ADC_CONNECTIONS (6 pins), Header Pinout (P1.9 P1.10 P3.8)
VCC: DEV Board (D1.1 D2.1), MCU_MKE185F512VLH16 (20 pins), CAN_Tranceiver (C1.2 C15.2 U1.3 U2.3), Header Pinout (P1.7 P1.8 P3.9)
A0_UART0_CTS: MCU_MKE185F512VLH16 (U3.50 U4.3), Header Pinout (P4.2)
A1_UART0_RTS: MCU_MKE185F512VLH16 (U3.49 U4.11), Header Pinout (P4.1)
A2_UART0_RX: MCU_MKE185F512VLH16 (R20.2 U3.48), Header Pinout (P3.16)
A3_UART0_TX: MCU_MKE185F512VLH16 (R21.2 U3.47), Header Pinout (P3.15)
A4: MCU_MKE185F512VLH16 (P6.2 R26.1 U3.64), Header Pinout (P4.16)
A5: MCU_MKE185F512VLH16 (6 pins), Header Pinout (P4.15)
A6_UART1_CTS: MCU_MKE185F512VLH16 (U3.38), Header Pinout (P3.6)
A7_UART1_RTS: MCU_MKE185F512VLH16 (U3.37), Header Pinout (P3.5)
A10: MCU_MKE185F512VLH16 (P6.6 U3.58), Header Pinout (P4.10)
A11: MCU_MKE185F512VLH16 (U3.57), Header Pinout (P4.9)
A12_CAN1_RX: MCU_MKE185F512VLH16 (U3.56), CAN_Tranceiver (U2.4), Header Pinout (P4.8)
A13_CAN1_TX: MCU_MKE185F512VLH16 (U3.55), CAN_Tranceiver (U2.1), Header Pinout (P4.7)
B0_SPI0_PCS0: MCU_MKE185F512VLH16 (U3.34), Header Pinout (P3.2)
B1_SPI0_SOUT: MCU_MKE185F512VLH16 (U3.33), Header Pinout (P3.1)
B2_SPI0_SCK: MCU_MKE185F512VLH16 (U3.32), Header Pinout (P2.16)
B3_SPI0_SIN: MCU_MKE185F512VLH16 (U3.31), Header Pinout (P2.15)
B4_SPI0_SOUT: MCU_MKE185F512VLH16 (U3.19), Header Pinout (P2.3)
B5_SPI0_PCS1: MCU_MKE185F512VLH16 (U3.18), Header Pinout (P2.2)
B6_I2C0_SDA: MCU_MKE185F512VLH16 (U3.12), Header Pinout (P1.12)
B7_I2C0_SCL: MCU_MKE185F512VLH16 (U3.11), Header Pinout (P1.11)
B12_ADC1_7_H: HVP_ADC_CONNECTIONS (R7.2), Header Pinout (P3.11)
B12_ADC1_7_M: MCU_MKE185F512VLH16 (U3.43), HVP_ADC_CONNECTIONS (D5.2 R7.1)
B13_ADC1_8_H: HVP_ADC_CONNECTIONS (R15.2), Header Pinout (P3.10)
B13_ADC1_8_M: MCU_MKE185F512VLH16 (U3.42), HVP_ADC_CONNECTIONS (D4.2 R15.1)
C0_ADC0_8_H: HVP_ADC_CONNECTIONS (R13.2), Header Pinout (P2.10)
C0_ADC0_8_M: MCU_MKE185F512VLH16 (U3.26), HVP_ADC_CONNECTIONS (D15.2 R13.1)
C1_ADC0_9_H: HVP_ADC_CONNECTIONS (R10.2), Header Pinout (P2.9)
C1_ADC0_9_M: MCU_MKE185F512VLH16 (U3.25), HVP_ADC_CONNECTIONS (D15.1 R10.1)
C2_ADC0_10_H: HVP_ADC_CONNECTIONS (R9.2), Header Pinout (P2.5)
C2_ADC0_10_M: MCU_MKE185F512VLH16 (U3.21), HVP_ADC_CONNECTIONS (D13.2 R9.1)
C3_ADC0_11_H: HVP_ADC_CONNECTIONS (R8.2), Header Pinout (P2.4)
C3_ADC0_11_M: MCU_MKE185F512VLH16 (U3.20), HVP_ADC_CONNECTIONS (D13.1 R8.1)
C4: MCU_MKE185F512VLH16 (P6.4 U3.62), Header Pinout (P4.14)
C5: MCU_MKE185F512VLH16 (P6.8 U3.61), Header Pinout (P4.13)
C6_UART1_RX: MCU_MKE185F512VLH16 (U3.52), Header Pinout (P4.4)
C7_UART1_TX: MCU_MKE185F512VLH16 (U3.51), Header Pinout (P4.3)
C8_UART1_RX: MCU_MKE185F512VLH16 (U3.36), Header Pinout (P3.4)
C9_UART1_TX: MCU_MKE185F512VLH16 (U3.35), Header Pinout (P3.3)
C14_ADC0_12_H: HVP_ADC_CONNECTIONS (R19.2), Header Pinout (P2.14)
C14_ADC0_12_M: MCU_MKE185F512VLH16 (U3.30), HVP_ADC_CONNECTIONS (D14.2 R19.1)
C15_ADC0_13_H: HVP_ADC_CONNECTIONS (R18.2), Header Pinout (P2.13)
C15_ADC0_13_M: MCU_MKE185F512VLH16 (R30.2 U3.29), HVP_ADC_CONNECTIONS (D14.1 R18.1)
C16: MCU_MKE185F512VLH16 (U3.28), Header Pinout (P2.12)
C17: MCU_MKE185F512VLH16 (U3.27), Header Pinout (P2.11)
D0_SPI1_SCK: MCU_MKE185F512VLH16 (U3.2), Header Pinout (P1.2)
D1_SPI1_SIN: MCU_MKE185F512VLH16 (U3.1), Header Pinout (P1.1)
D2_SPI1_SOUT: MCU_MKE185F512VLH16 (U3.46), Header Pinout (P3.14)
D3_SPI1_PCS0: MCU_MKE185F512VLH16 (U3.45), Header Pinout (P3.13)
D4_ADC1_6_H: HVP_ADC_CONNECTIONS (R6.2), Header Pinout (P3.12)
D4_ADC1_6_M: MCU_MKE185F512VLH16 (R31.2 U3.44), HVP_ADC_CONNECTIONS (D5.1 R6.1)
D5: MCU_MKE185F512VLH16 (U3.24), Header Pinout (P2.8)
D6_UART2_RX: MCU_MKE185F512VLH16 (U3.23), Header Pinout (P2.7)
D7_UART2_TX: MCU_MKE185F512VLH16 (U3.22), Header Pinout (P2.6)
D15_LED_R2: DEV Board (M2.1), MCU_MKE185F512VLH16 (U3.15), Header Pinout (P1.15)
D16_LED_R1: DEV Board (M1.1), MCU_MKE185F512VLH16 (U3.14), Header Pinout (P1.14)
E0_I2C1_SDA: MCU_MKE185F512VLH16 (U3.60), Header Pinout (P4.12)
E1_I2C1_SCL: MCU_MKE185F512VLH16 (U3.59), Header Pinout (P4.11)
E2_SPI0_SOUT: MCU_MKE185F512VLH16 (U3.54), Header Pinout (P4.6)
E3_UART2_RTS: MCU_MKE185F512VLH16 (U3.13), Header Pinout (P1.13)
E4_CAN0_RX: MCU_MKE185F512VLH16 (U3.6), CAN_Tranceiver (U1.4), Header Pinout (P1.6)
E5_CAN0_TX: MCU_MKE185F512VLH16 (U3.5), CAN_Tranceiver (U1.1), Header Pinout (P1.5)
E6_SPI0_PCS2: MCU_MKE185F512VLH16 (U3.53), Header Pinout (P4.5)
E7_ADC2_2_H: HVP_ADC_CONNECTIONS (R14.2), Header Pinout (P3.7)
E7_ADC2_2_M: MCU_MKE185F512VLH16 (U3.39), HVP_ADC_CONNECTIONS (D4.1 R14.1)
E8: MCU_MKE185F512VLH16 (U3.17), Header Pinout (P2.1)
E9_UART2_CTS: MCU_MKE185F512VLH16 (U3.16), Header Pinout (P1.16)
E10_ADC2_12_H: HVP_ADC_CONNECTIONS (R17.2), Header Pinout (P1.4)
E10_ADC2_12_M: MCU_MKE185F512VLH16 (U3.4), HVP_ADC_CONNECTIONS (D16.2 R17.1)
E11_ADC2_13_H: HVP_ADC_CONNECTIONS (R16.2), Header Pinout (P1.3)
E11_ADC2_13_M: MCU_MKE185F512VLH16 (R29.2 U3.3), HVP_ADC_CONNECTIONS (D16.1 R16.1)